# EAGLE schematic lh (EAGLE 6.2)
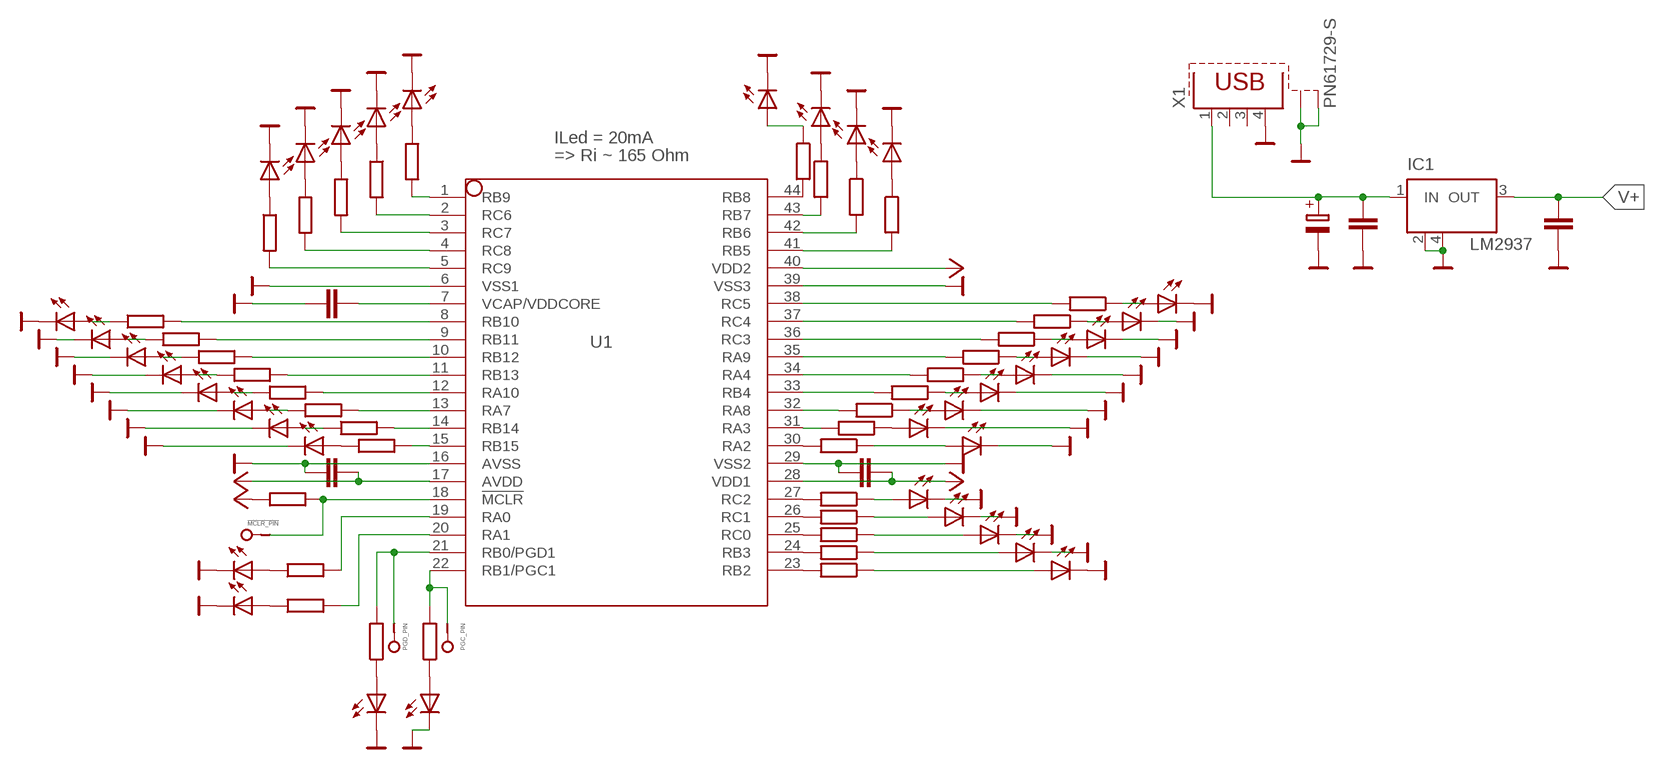
[diagram p0: schematic, sheet 1]

## Parts
!MCLR_PIN  1_PIN_CONPLANAR  [1_PIN_PLANAR]
C1  SMD_CAPC0805K  [C0805K]
C2  SMD_CAPC0805K  [C0805K]
C3  SMD_CAPC0805K  [C0805K]
C5  SMD_CAPC0805K  [C0805K]
C6  SMD_CAPC0805K  [C0805K]
C7  SMD_EL_CAP  [153CLV-0405]
IC1  LM2937  [SOT223]
LED1  LEDSMT1206  [1206]
LED2  LEDSMT1206  [1206]
LED3  LEDSMT1206  [1206]
LED4  LEDSMT1206  [1206]
LED5  LEDSMT1206  [1206]
LED6  LEDSMT1206  [1206]
LED7  LEDSMT1206  [1206]
LED8  LEDSMT1206  [1206]
LED9  LEDSMT1206  [1206]
LED10  LEDSMT1206  [1206]
LED11  LEDSMT1206  [1206]
LED12  LEDSMT1206  [1206]
LED13  LEDSMT1206  [1206]
LED14  LEDSMT1206  [1206]
LED15  LEDSMT1206  [1206]
LED16  LEDSMT1206  [1206]
LED17  LEDSMT1206  [1206]
LED18  LEDSMT1206  [1206]
LED19  LEDSMT1206  [1206]
LED20  LEDSMT1206  [1206]
LED21  LEDSMT1206  [1206]
LED22  LEDSMT1206  [1206]
LED23  LEDSMT1206  [1206]
LED24  LEDSMT1206  [1206]
LED25  LEDSMT1206  [1206]
LED26  LEDSMT1206  [1206]
LED27  LEDSMT1206  [1206]
LED28  LEDSMT1206  [1206]
LED29  LEDSMT1206  [1206]
LED30  LEDSMT1206  [1206]
LED31  LEDSMT1206  [1206]
LED32  LEDSMT1206  [1206]
LED33  LEDSMT1206  [1206]
LED34  LEDSMT1206  [1206]
LED35  LEDSMT1206  [1206]
PGC_PIN  1_PIN_CONPLANAR  [1_PIN_PLANAR]
PGD_PIN  1_PIN_CONPLANAR  [1_PIN_PLANAR]
R1  SMD_RES  [R1206]
R2  SMD_RES  [R1206]
R3  SMD_RES  [R1206]
R4  SMD_RES  [R1206]
R5  SMD_RES  [R1206]
R6  SMD_RES  [R1206]
R7  SMD_RES  [R1206]
R8  SMD_RES  [R1206]
R9  SMD_RES  [R1206]
R10  SMD_RES  [R1206]
R11  SMD_RES  [R1206]
R12  SMD_RES  [R1206]
R13  SMD_RES  [R1206]
R14  SMD_RES  [R1206]
R15  SMD_RES  [R1206]
R16  SMD_RES  [R1206]
R17  SMD_RES  [R1206]
R18  SMD_RES  [R1206]
R19  SMD_RES  [R1206]
R20  SMD_RES  [R1206]
R21  SMD_RES  [R1206]
R22  SMD_RES  [R1206]
R23  SMD_RES  [R1206]
R24  SMD_RES  [R1206]
R25  SMD_RES  [R1206]
R26  SMD_RES  [R1206]
R27  SMD_RES  [R1206]
R28  SMD_RES  [R1206]
R29  SMD_RES  [R1206]
R30  SMD_RES  [R1206]
R31  SMD_RES  [R1206]
R32  SMD_RES  [R1206]
R33  SMD_RES  [R1206]
R34  SMD_RES  [R1206]
R35  SMD_RES  [R1206]
R36  SMD_RES  [R1206]
U1  DSPIC33FJ64GP204  [TQFP44]
X1  PN61729-S  [PN61729-S]

## Nets
0V: C1.2 C2.2 C3.1 C5.2 C6.2 C7.- IC1.2(GND) IC1.4(GND) LED1.C LED2.C LED3.C LED4.C LED5.C LED6.C LED7.C LED8.C LED9.C LED10.C LED11.C LED12.C LED13.C LED14.C LED15.C LED16.C LED17.C LED18.C LED19.C LED20.C LED21.C LED22.C LED23.C LED24.C LED25.C LED26.C LED27.C LED28.C LED29.C LED30.C LED31.C LED32.C LED33.C LED34.C LED35.C U1.6(VSS1) U1.16(AVSS) U1.29(VSS2) U1.39(VSS3) X1.4 X1.S1 X1.S2
+5V_USB: C2.1 C7.+ IC1.1(IN) X1.1
N$1: R1.2 U1.1(RB9)
N$2: LED1.A R1.1
N$3: LED2.A R2.1
N$4: R2.2 U1.2(RC6)
N$5: LED3.A R3.1
N$6: R3.2 U1.3(RC7)
N$7: R4.2 U1.4(RC8)
N$8: R5.2 U1.5(RC9)
N$9: R6.2 U1.44(RB8)
N$10: LED4.A R4.1
N$11: LED5.A R5.1
N$12: LED6.A R6.1
N$13: C1.1 U1.7(VCAP/VDDCORE)
N$14: R16.2 U1.19(RA0)
N$15: R7.2 U1.8(RB10)
N$16: R8.2 U1.9(RB11)
N$17: R9.2 U1.10(RB12)
N$18: R10.2 U1.11(RB13)
N$19: R11.2 U1.12(RA10)
N$20: R12.2 U1.13(RA7)
N$21: R13.2 U1.14(RB14)
N$22: R14.2 U1.15(RB15)
N$23: LED7.A R13.1
N$24: LED8.A R14.1
N$25: LED14.A R7.1
N$26: LED13.A R8.1
N$27: LED12.A R9.1
N$28: LED11.A R10.1
N$29: LED10.A R11.1
N$30: LED9.A R12.1
N$31: !MCLR_PIN.P$1 R15.2 U1.18(!MCLR)
N$32: R17.2 U1.20(RA1)
N$33: LED15.A R16.1
N$34: PGD_PIN.P$1 R18.2 U1.21(RB0/PGD1)
N$35: LED16.A R17.1
N$36: LED17.A R18.1
N$37: LED18.A R19.1
N$38: LED19.A R20.1
N$39: LED20.A R21.1
N$40: R20.2 U1.43(RB7)
N$41: R21.2 U1.42(RB6)
N$42: R22.2 U1.41(RB5)
N$43: LED21.A R22.1
N$44: PGC_PIN.P$1 R19.2 U1.22(RB1/PGC1)
N$45: R23.2 U1.38(RC5)
N$46: R24.2 U1.37(RC4)
N$47: R25.2 U1.36(RC3)
N$48: R26.2 U1.35(RA9)
N$49: R27.2 U1.34(RA4)
N$50: R28.2 U1.33(RB4)
N$51: R29.2 U1.32(RA8)
N$52: R30.2 U1.31(RA3)
N$53: LED22.A R29.1
N$54: LED23.A R30.1
N$55: LED29.A R23.1
N$56: LED28.A R24.1
N$57: LED27.A R25.1
N$58: LED26.A R26.1
N$59: LED25.A R27.1
N$60: LED24.A R28.1
N$61: R31.2 U1.30(RA2)
N$62: LED30.A R31.1
N$63: R32.2 U1.27(RC2)
N$64: R33.2 U1.26(RC1)
N$65: R34.2 U1.25(RC0)
N$66: R35.2 U1.24(RB3)
N$67: R36.2 U1.23(RB2)
N$68: LED35.A R32.1
N$69: LED34.A R33.1
N$70: LED33.A R34.1
N$71: LED32.A R35.1
N$72: LED31.A R36.1
V+: C3.2 C5.1 C6.1 IC1.3(OUT) R15.1 U1.17(AVDD) U1.28(VDD1) U1.40(VDD2)
Unconnected: X1.2 X1.3

## Notes on the sheet
- ILed = 20mA
- => Ri ~ 165 Ohm

## Library data of the parts
!MCLR_PIN PGC_PIN PGD_PIN = Dmitry:1_PIN_CON
C1-C3 C5 C6 = Dmitry:SMD_CAP: CAPACITOR, European symbol
C7 = Dmitry:SMD_EL_CAP
IC1 = Dmitry:LM2937: 3-Terminal Positive Regulators
LED1-LED35 = led:LED: LED OSRAM: - CHIPLED LG R971, LG N971, LY N971, LG Q971, LY Q971, LO R971, LY R971 LH N974, LH R974 LS Q976, LO Q976, LY Q976 LO Q996 - Hyper CHIPLED LW Q18S LB Q993, LB Q99A, LB R99A - SideLED LS A670, LO A670, LY A670, LG A670, LP A670 LB A673, LV A673, LT A673, LW A673 LH A674 LY A675 LS A676, LA A676, LO A676, LY A676, LW A676 LS A679, LY A679, LG A679 - Hyper Micro SIDELED® LS Y876, LA Y876, LO Y876, LY Y876 LT Y87S - SmartLED LW L88C, LW L88S LB L89C, LB L89S, LG L890 LS L89K, LO L89K, LY L89K LS L896, LA L896, LO L896, LY L896 - TOPLED LS T670, LO T670, LY T670, LG T670, LP T670 LSG T670, LSP T670, LSY T670, LOP T670, LYG T670 LG T671, LOG T671, LSG T671 LB T673, LV T673, LT T673, LW T673 LH T674 LS T676, LA T676, LO T676, LY T676, LB T676, LH T676, LSB T676, LW T676 LB T67C, LV T67C, LT T67C, LS T67K, LO T67K, LY T67K, LW E67C LS E67B, LA E67B, LO E67B, LY E67B, LB E67C, LV E67C, LT E67C LW T67C LS T679, LY T679, LG T679 LS T770, LO T770, LY T770, LG T770, LP T770 LB T773, LV T773, LT T773, LW T773 LH T774 LS E675, LA E675, LY E675, LS T675 LS T776, LA T776, LO T776, LY T776, LB T776 LHGB T686 LT T68C, LB T68C - Hyper Mini TOPLED® LB M676 - Mini TOPLED Santana® LG M470 LS M47K, LO M47K, LY M47K Source: http://www.osram.convergy.de LUXEON: - LUMILED® LXK2-PW12-R00, LXK2-PW12-S00, LXK2-PW14-U00, LXK2-PW14-V00 LXK2-PM12-R00, LXK2-PM12-S00, LXK2-PM14-U00 LXK2-PE12-Q00, LXK2-PE12-R00, LXK2-PE12-S00, LXK2-PE14-T00, LXK2-PE14-U00 LXK2-PB12-K00, LXK2-PB12-L00, LXK2-PB12-M00, LXK2-PB14-N00, LXK2-PB14-P00, LXK2-PB14-Q00 LXK2-PR12-L00, LXK2-PR12-M00, LXK2-PR14-Q00, LXK2-PR14-R00 LXK2-PD12-Q00, LXK2-PD12-R00, LXK2-PD12-S00 LXK2-PH12-R00, LXK2-PH12-S00 LXK2-PL12-P00, LXK2-PL12-Q00, LXK2-PL12-R00 Source: www.luxeon.com KINGBRIGHT: KA-3528ASYC Source: www.kingbright.com
R1-R36 = Dmitry:SMD_RES
U1 = Dmitry:DSPIC33FJ64GP204: dsPIC33 edit this description Auto generated by make-symbol-device-package-bsdl.ulp Rev. 25
X1 = con-berg:PN61729-S: BERG USB connector; OC_FARNELL: unknown; OC_NEWARK: unknown